# Altium project EDR_MCU_Main - Copy.PrjPcb
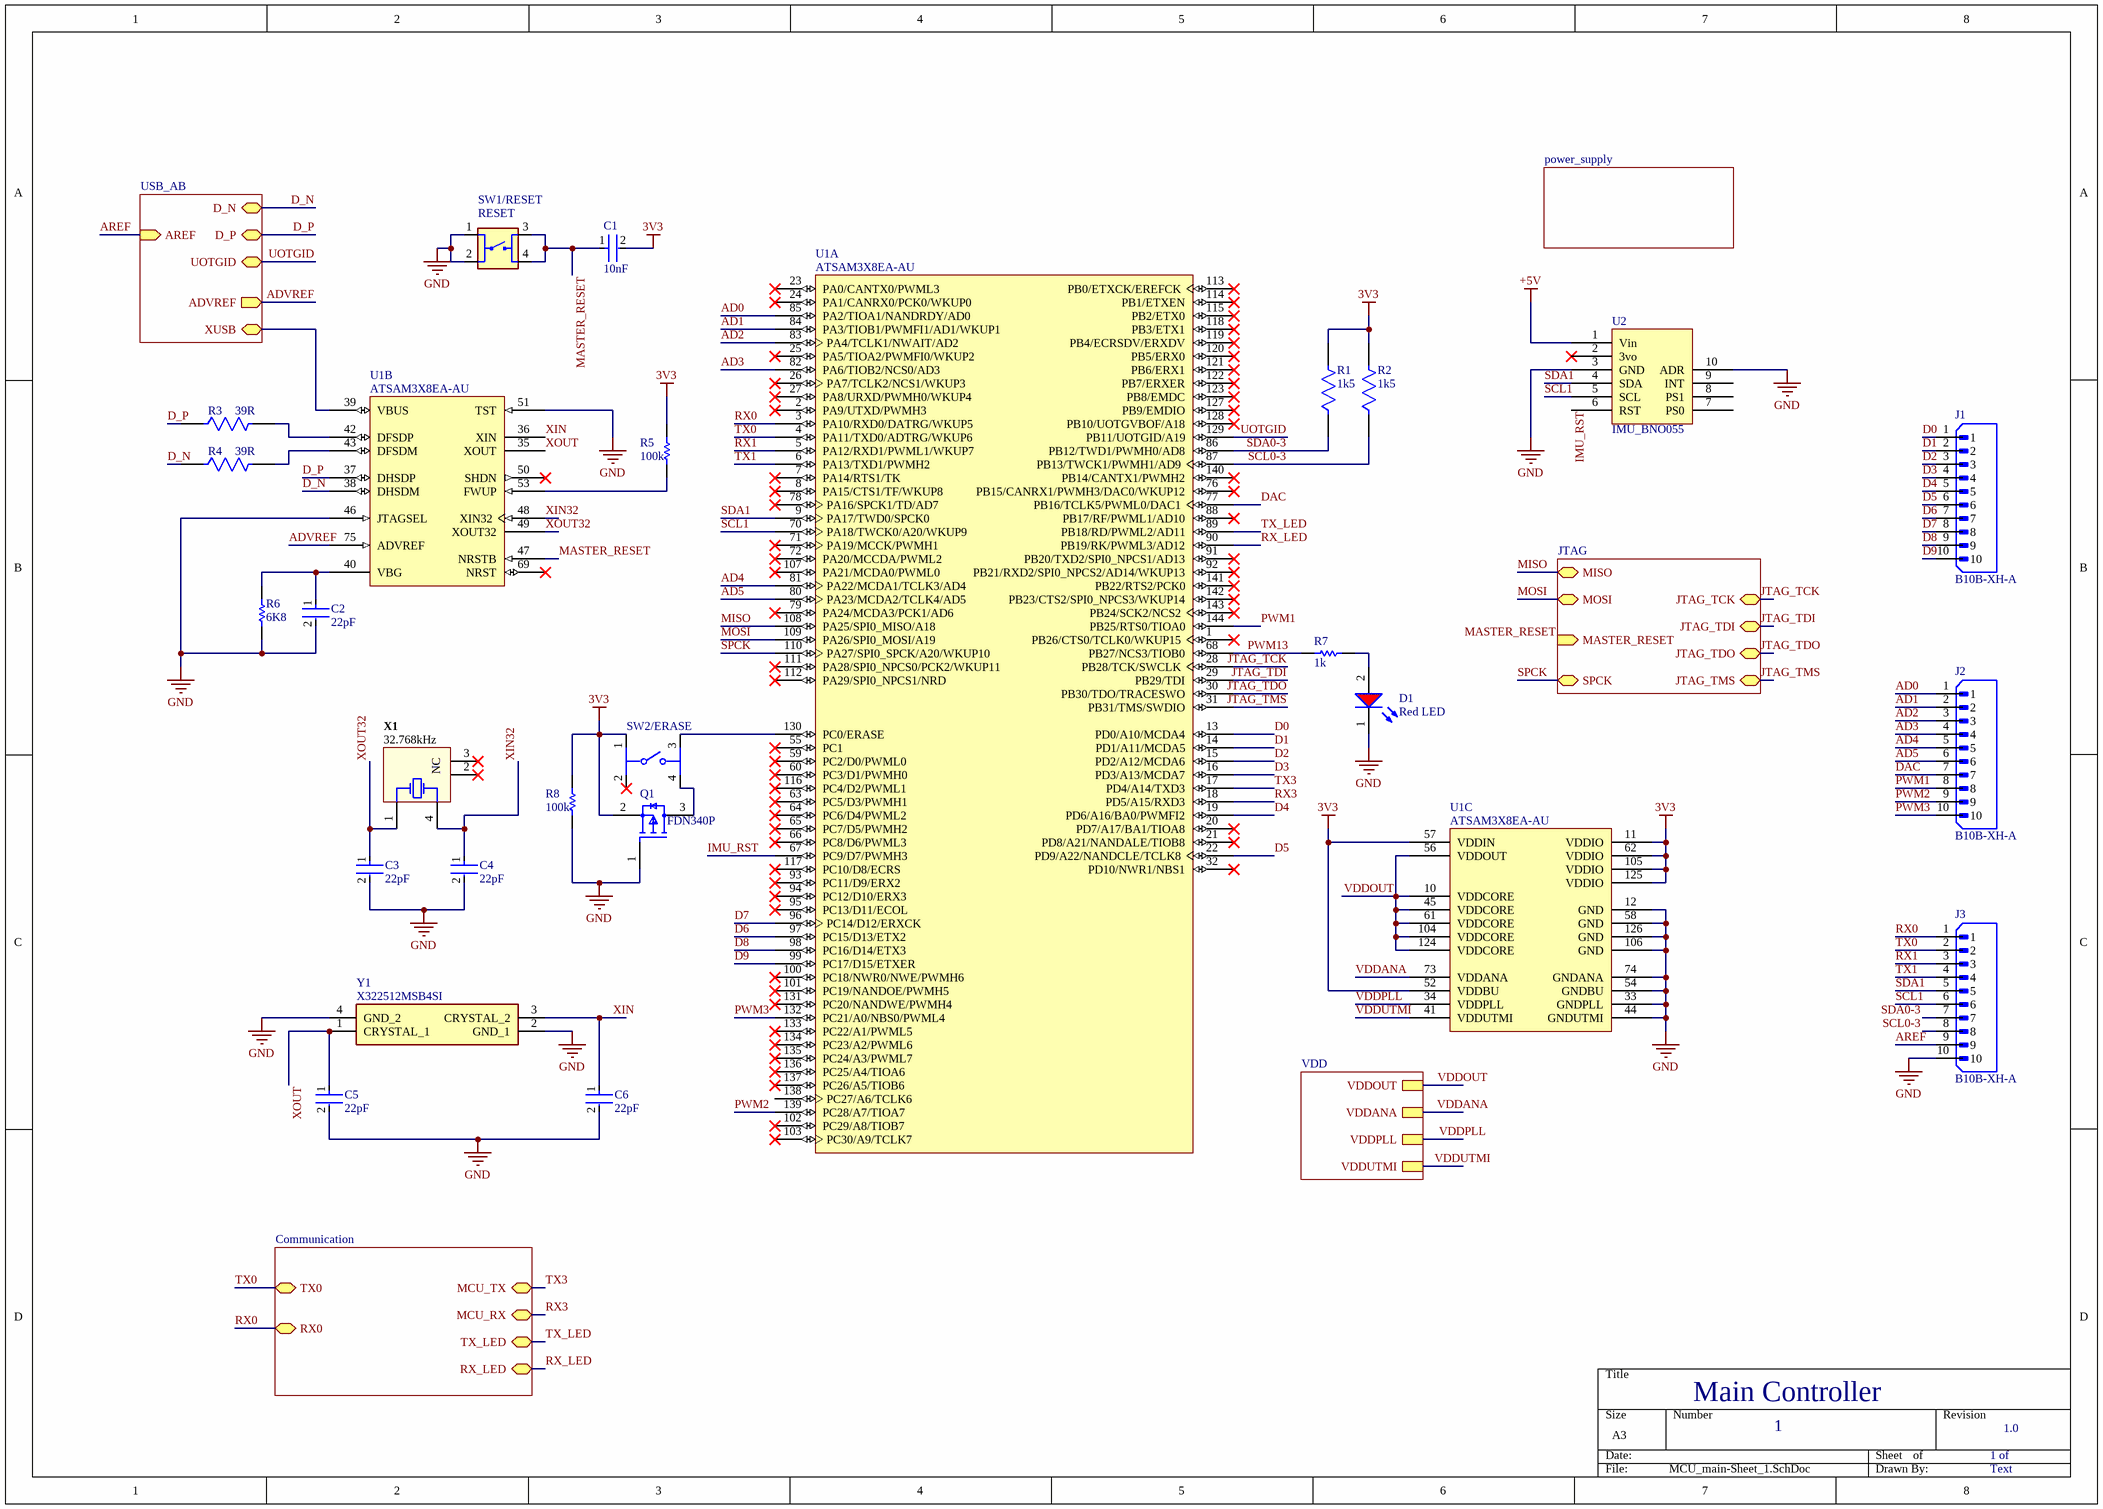
[diagram p0:  MCU_main-Sheet_1.SchDoc]
6 sheets, 98 parts. Net scope: hierarchical (ports join the sheet entries above them; power ports are global).
Board file:  PCB_1.PcbDoc
Sheets:
   MCU_main-Sheet_1.SchDoc
   USB_AB.SchDoc
   JTAG.SchDoc
   VDD.SchDoc
   power_supply.SchDoc
   Communication.SchDoc

## Sheet  MCU_main-Sheet_1.SchDoc
size A3

### Parts
C1  10nF  [FP-C0805C-DN-MFG]
C2  22pF  [FP-C0805C-DN-MFG]
C3  22pF  [FP-C0805C-DN-MFG]
C4  22pF  [FP-C0805C-DN-MFG]
C5  22pF  [FP-C0805C-DN-MFG]
C6  22pF  [FP-C0805C-DN-MFG]
D1  Red LED  [WL-SMCW_0603_150060xx75000]
J1  B10B-XH-A  [JST_B10B-XH-A]
J2  B10B-XH-A  [JST_B10B-XH-A]
J3  B10B-XH-A  [JST_B10B-XH-A]
Q1  FDN340P  [FP-527AG-MFG]
R1  1k5  [FP-RT0805-MFG]
R2  1k5  [FP-RT0805-MFG]
R3  39R  [FP-RK73H2A-MFG]
R4  39R  [FP-RK73H2A-MFG]
R5  100k  [RESC2013X50X30ML20T20]
R6  6K8  [RESC2013X50X30LL20T20]
R7  1k  [RESC2013X60X35ML10T20]
R8  100k  [RESC2013X50X30ML20T20]
SW1/RESET  RESET  [TE_4-1437565-9]
SW2/ERASE  3-1825910-1  [FP-3-1825910-1-MFG]  (value not drawn)
U1  ATSAM3X8EA-AU  [LQFP144_M]  (parts A,B,C of 3)
U2  IMU_BNO055  [IMU_BNO055-Footprint-1]
X1  32.768kHz  [ABRA-ABS25-4_V]
Y1  X322512MSB4SI  [X322512MSB4SI]

### Sub-sheets
Communication = Communication (file not in this document): MCU_TX (bidir), MCU_RX (bidir), TX_LED (bidir), RX_LED (bidir), RX0 (bidir), TX0 (bidir)
JTAG = JTAG (file not in this document): JTAG_TDI (bidir), JTAG_TCK (bidir), JTAG_TDO (bidir), JTAG_TMS (bidir), MASTER_RESET (in), MOSI (bidir), MISO (bidir), SPCK (bidir)
power_supply = power_supply (file not in this document): no entries
USB_AB = USB_AB (file not in this document): D_N (bidir), D_P (bidir), UOTGID (bidir), XUSB (bidir), ADVREF (out), AREF (in)
VDD = VDD (file not in this document): VDDOUT, VDDANA, VDDPLL, VDDUTMI

### Nets
3V3: C1.2 Q1.2(S) R1.2 R2.2 R5.2 R8.2 SW2/ERASE.1 U1.11(VDDIO) U1.52(VDDBU) U1.57(VDDIN) U1.62(VDDIO) U1.105(VDDIO) U1.125(VDDIO)
+5V: U2.1(Vin)
GND: C2.2 C3.2 C4.2 C5.2 C6.2 D1.1(K) J3.10 Q1.1(G) R6.1 R8.1 SW1/RESET.1 SW1/RESET.2 U1.12(GND) U1.33(GNDPLL) U1.44(GNDUTMI) U1.46(JTAGSEL) U1.51(TST) U1.54(GNDBU) U1.58(GND) U1.74(GNDANA) U1.106(GND) U1.126(GND) U2.3(GND) U2.10(ADR) Y1.2(GND_1) Y1.4(GND_2)
AD0: J2.1 U1.85(PA2/TIOA1/NANDRDY/AD0)
AD1: J2.2 U1.84(PA3/TIOB1/PWMFI1/AD1/WKUP1)
AD2: J2.3 U1.83(PA4/TCLK1/NWAIT/AD2)
AD3: J2.4 U1.82(PA6/TIOB2/NCS0/AD3)
AD4: J2.5 U1.81(PA22/MCDA1/TCLK3/AD4)
AD5: J2.6 U1.80(PA23/MCDA2/TCLK4/AD5)
ADVREF: U1.75(ADVREF) ; sheet USB_AB/ADVREF
AREF: J3.9 ; sheet USB_AB/AREF
D0: J1.1 U1.13(PD0/A10/MCDA4)
D1: J1.2 U1.14(PD1/A11/MCDA5)
D2: J1.3 U1.15(PD2/A12/MCDA6)
D3: J1.4 U1.16(PD3/A13/MCDA7)
D4: J1.5 U1.19(PD6/A16/BA0/PWMFI2)
D5: J1.6 U1.22(PD9/A22/NANDCLE/TCLK8)
D6: J1.7 U1.97(PC15/D13/ETX2)
D7: J1.8 U1.96(PC14/D12/ERXCK)
D8: J1.9 U1.98(PC16/D14/ETX3)
D9: J1.10 U1.99(PC17/D15/ETXER)
D_N: R4.1 U1.38(DHSDM) ; sheet USB_AB/D_N
D_P: R3.1 U1.37(DHSDP) ; sheet USB_AB/D_P
DAC: J2.7 U1.77(PB16/TCLK5/PWML0/DAC1)
IMU_RST: U1.67(PC9/D7/PWMH3) U2.6(RST)
JTAG_TCK: U1.28(PB28/TCK/SWCLK) ; sheet JTAG/JTAG_TCK
JTAG_TDI: U1.29(PB29/TDI) ; sheet JTAG/JTAG_TDI
JTAG_TDO: U1.30(PB30/TDO/TRACESWO) ; sheet JTAG/JTAG_TDO
JTAG_TMS: U1.31(PB31/TMS/SWDIO) ; sheet JTAG/JTAG_TMS
MASTER_RESET: C1.1 SW1/RESET.3 SW1/RESET.4 U1.47(NRSTB) ; sheet JTAG/MASTER_RESET
MISO: U1.108(PA25/SPI0_MISO/A18) ; sheet JTAG/MISO
MOSI: U1.109(PA26/SPI0_MOSI/A19) ; sheet JTAG/MOSI
PWM1: J2.8 U1.144(PB25/RTS0/TIOA0)
PWM2: J2.9 U1.139(PC28/A7/TIOA7)
PWM3: J2.10 U1.132(PC21/A0/NBS0/PWML4)
PWM13: R7.2 U1.68(PB27/NCS3/TIOB0)
RX0: J3.1 U1.3(PA10/RXD0/DATRG/WKUP5) ; sheet Communication/RX0
RX1: J3.3 U1.5(PA12/RXD1/PWML1/WKUP7)
RX3: U1.18(PD5/A15/RXD3) ; sheet Communication/MCU_RX
RX_LED: U1.90(PB19/RK/PWML3/AD12) ; sheet Communication/RX_LED
SCL0-3: J3.8 R2.1 U1.87(PB13/TWCK1/PWMH1/AD9)
SCL1: J3.6 U1.70(PA18/TWCK0/A20/WKUP9) U2.5(SCL)
SDA0-3: J3.7 R1.1 U1.86(PB12/TWD1/PWMH0/AD8)
SDA1: J3.5 U1.9(PA17/TWD0/SPCK0) U2.4(SDA)
SPCK: U1.110(PA27/SPI0_SPCK/A20/WKUP10) ; sheet JTAG/SPCK
TX0: J3.2 U1.4(PA11/TXD0/ADTRG/WKUP6) ; sheet Communication/TX0
TX1: J3.4 U1.6(PA13/TXD1/PWMH2)
TX3: U1.17(PD4/A14/TXD3) ; sheet Communication/MCU_TX
TX_LED: U1.89(PB18/RD/PWML2/AD11) ; sheet Communication/TX_LED
UOTGID: U1.129(PB11/UOTGID/A19) ; sheet USB_AB/UOTGID
VDDANA: U1.73(VDDANA) ; sheet VDD/VDDANA
VDDOUT: U1.10(VDDCORE) U1.45(VDDCORE) U1.56(VDDOUT) U1.61(VDDCORE) U1.104(VDDCORE) U1.124(VDDCORE) ; sheet VDD/VDDOUT
VDDPLL: U1.34(VDDPLL) ; sheet VDD/VDDPLL
VDDUTMI: U1.41(VDDUTMI) ; sheet VDD/VDDUTMI
XIN: C6.1 U1.36(XIN) Y1.3(CRYSTAL_2)
XIN32: C4.1 U1.48(XIN32) X1.4(X2)
XOUT: C5.1 U1.35(XOUT) Y1.1(CRYSTAL_1)
XOUT32: C3.1 U1.49(XOUT32) X1.1(X1)
NetC2_1: C2.1 R6.2 U1.40(VBG)
NetD1_2: D1.2(A) R7.1
NetQ1_3: Q1.3(D) SW2/ERASE.4
NetR3_2: R3.2 U1.42(DFSDP)
NetR4_2: R4.2 U1.43(DFSDM)
NetR5_1: R5.1 U1.53(FWUP)
NetSW2/ERASE_3: SW2/ERASE.3 U1.130(PC0/ERASE)
NetU1_39: U1.39(VBUS) ; sheet USB_AB/XUSB

Not connected (* = marked no-connect by the designer): SW2/ERASE 2*; U1 1(PB26/CTS0/TCLK0/WKUP15)* 2(PA9/UTXD/PWMH3)* 7(PA14/RTS1/TK)* 8(PA15/CTS1/TF/WKUP8)* 20(PD7/A17/BA1/TIOA8)* 21(PD8/A21/NANDALE/TIOB8)* 23(PA0/CANTX0/PWML3)* 24(PA1/CANRX0/PCK0/WKUP0)* 25(PA5/TIOA2/PWMFI0/WKUP2)* 26(PA7/TCLK2/NCS1/WKUP3)* 27(PA8/URXD/PWMH0/WKUP4)* 32(PD10/NWR1/NBS1)* 50(SHDN)* 55(PC1)* 59(PC2/D0/PWML0)* 60(PC3/D1/PWMH0)* 63(PC5/D3/PWMH1)* 64(PC6/D4/PWML2)* 65(PC7/D5/PWMH2)* 66(PC8/D6/PWML3)* 69(NRST)* 71(PA19/MCCK/PWMH1)* 72(PA20/MCCDA/PWML2)* 76(PB15/CANRX1/PWMH3/DAC0/WKUP12)* 78(PA16/SPCK1/TD/AD7)* 79(PA24/MCDA3/PCK1/AD6)* 88(PB17/RF/PWML1/AD10)* 91(PB20/TXD2/SPI0_NPCS1/AD13)* 92(PB21/RXD2/SPI0_NPCS2/AD14/WKUP13)* 93(PC11/D9/ERX2)* 94(PC12/D10/ERX3)* 95(PC13/D11/ECOL)* 100(PC18/NWR0/NWE/PWMH6)* 101(PC19/NANDOE/PWMH5)* 102(PC29/A8/TIOB7)* 103(PC30/A9/TCLK7)* 107(PA21/MCDA0/PWML0)* 111(PA28/SPI0_NPCS0/PCK2/WKUP11)* 112(PA29/SPI0_NPCS1/NRD)* 113(PB0/ETXCK/EREFCK)* 114(PB1/ETXEN)* 115(PB2/ETX0)* 116(PC4/D2/PWML1)* 117(PC10/D8/ECRS)* 118(PB3/ETX1)* 119(PB4/ECRSDV/ERXDV)* 120(PB5/ERX0)* 121(PB6/ERX1)* 122(PB7/ERXER)* 123(PB8/EMDC)* 127(PB9/EMDIO)* 128(PB10/UOTGVBOF/A18)* 131(PC20/NANDWE/PWMH4)* 133(PC22/A1/PWML5)* 134(PC23/A2/PWML6)* 135(PC24/A3/PWML7)* 136(PC25/A4/TIOA6)* 137(PC26/A5/TIOB6)* 138(PC27/A6/TCLK6) 140(PB14/CANTX1/PWMH2)* 141(PB22/RTS2/PCK0)* 142(PB23/CTS2/SPI0_NPCS3/WKUP14)* 143(PB24/SCK2/NCS2)*; U2 2(3vo)* 7(PS0) 8(PS1) 9(INT); X1 2(NC)* 3(NC)*

### Notes on the sheet
- Main Controller
- 1
- 1 of
- 1.0
- Text

### Library data of the parts
C1 = CMP-2007-00259-2: CAP CER 10000PF 200V X7R 0805; Manufacturer Part Number: C0805C103K2RACTU; Manufacturer: KEMET; Material: Ceramic; Temperature Coefficient: 30ppm/°C; Capacitance: 10,000 pF; Tolerance: 0.1; Value: 10,000 pF; Device Class L2: Capacitors; Voltage Rating: 200 V; Temperature Range High: +125°C; ComponentLink2Description: Datasheet; Height: 0.88mm; Octopart: https://octopart.com/c0805c103k2ractu-kemet-9138347; ComponentLink2URL: https://content.kemet.com/datasheets/KEM_C1003_C0G_SMD.pdf; Category: Cap; Temperature: -55°C to +125°C; Temperature Range Low: -55°C; Digikey Description: CAP CER 10000PF 200V X7R 0805; Temperature Characteristic: X7R; Automotive: No; Device Class L3: Ceramic Capacitors; Mouser Description: KEMET - C0805C103K2RACTU - CAP, MLCC, X7R, 10NF, 200V, 0805; RoHS: TRUE; Device Class L1: Passive Components; Lead Free: Yes; Package: C0805C-DN; Ipc Land Pattern Name: CAPC200125X78
C2-C6 = CMP-2007-00048-2: Capacitor; Ceramic; Cap; 22.0pF; Tol 5%; SMT; Vol-Rtg 50V; C0G; Tape and Reel; Manufacturer: KEMET; Manufacturer Part Number: C0805C220J5GACTU; Temperature Coefficient: 30ppm/°C; Tolerance: 0.05; Device Class L1: Passive Components; Mouser Description: Multilayer Ceramic Capacitors MLCC - SMD/SMT 50volts 22pF C0G 5%; Temperature Range Low: -55°C; Automotive: No; Voltage Rating: 50 V; Material: Ceramic; Category: Cap; Height: 0.88mm; Temperature Range High: +125°C; Capacitance: 22 pF; Digikey Description: Capacitor; Ceramic; Cap; 22.0pF; Tol 5%; SMT; Vol-Rtg 50V; C0G; Tape and Reel; Octopart: https://octopart.com/c0805c220j5gactu-kemet-145470; ComponentLink2Description: Datasheet; Device Class L2: Capacitors; Ipc Land Pattern Name: CAPC200125X78; Value: 22 pF; RoHS: TRUE; ComponentLink2URL: https://content.kemet.com/datasheets/KEM_C1003_C0G_SMD.pdf; Temperature: -55°C to +125°C; Device Class L3: Ceramic Capacitors; Lead Free: Yes; Temperature Characteristic: C0G; Package: C0805C-DN
D1 = CMP-1426-00001-4: LED Low-Power Uni-Color Red 630nm 2V 2-Pin Chip 0603(1608Metric) T/R; Max Junction Temperature (Tj): 95°C; Dominant Wavelength: 625nm; Lens Style: Clear, Rectangular; Viewing Angle: 140°; Forward Current: 100mA; Max Reverse Voltage (DC): 5V; Luminous Intensity: 250mcd; Test Current: 20mA; Power Dissipation: 72mW; Max Operating Temperature: 85°C; Mount: Surface Mount; Height: 700µm; Packaging: Tape and Reel; REACH SVHC: Unknown; Case Code (Metric): 1608; Peak Wavelength: 630nm; Forward Voltage: 2V; Case/Package: 0603; Color: Red; RoHS: Compliant; Width: 800µm; Reverse Voltage: 5V; Min Operating Temperature: -40°C; Wavelength: 625nm; Case Code (Imperial): 0603; Length: 1.6mm
J1-J3 = B10B-XH-A: MF: {'manufacturer': u'JST Sales America Inc.'}; Package: None; Price: None; Value: *; MP: B10B-XH-A; Availability: Unavailable
Q1 = CMP-2100-03638-2: MOSFET P-CH 20V 2A SSOT3; Fall Time: 11ns; Rise Time: 9ns; Voltage Rating (DC): -20V; Power Dissipation: 500mW; Nominal Vgs: -800mV; Current Rating: -2A; Gate to Source Voltage (Vgs): 8V; Rds On Max: 70mR; Turn-Off Delay Time: 27ns; Element Configuration: Single; Number of Elements: 1; Input Capacitance: 779pF; Drain to Source Resistance: 60mR; Turn-On Delay Time: 10ns; Package Quantity: 1; Mount: Surface Mount; Case/Package: SOT-23; Min Operating Temperature: -55°C; REACH SVHC: No SVHC; Weight: 0.03g; Packaging: Tape and Reel; Threshold Voltage: -800mV; Max Operating Temperature: 150°C; Dual Supply Voltage: -20V; Termination: SMD/SMT; Drain to Source Voltage (Vdss): 20V; Height: 0.94mm; Length: 2.92mm; Contact Plating: Tin; Width: 3.05mm; Drain to Source Breakdown Voltage: -20V; Max Power Dissipation: 500mW; Continuous Drain Current (ID): 2A; Number of Pins: 3; Lead Free: Lead Free; Radiation Hardening: No; On-State Resistance: 70MR
R1 R2 = CMP-03412-013884-1: RES SMD 1.5K OHM 0.25% 1/8W 0805; Manufacturer Part Number: RT0805CRE071K5L; Manufacturer: Yageo; Resistance: 1.5KΩ; Power Rating: 0.125W; Temperature Coefficient: 50 ppm/°C; Tolerance: 0.005; Voltage Rating: 150V; Value: 1.5KΩ; Temperature Range Low: -55°C; Height: 0.6mm; Octopart: https://octopart.com/rt0805cre071k5l-yageo-1182744; Lead Free: Yes; Device Class L2: Resistors; Package: RT0805; Device Class L1: Passive Components; Composition: Thin Film; Automotive: No; Temperature Range High: +155°C; Category: Res; Temperature: -55°C to +155°C; Device Class L3: Chip SMD Resistors; RoHS: TRUE; Digikey Description: RES SMD 1.5K OHM 0.25% 1/8W 0805; Footprint Url: http://www.yageo.com/exep/pages/download/literatures/PYu-R_Mount_10.pdf; ComponentLink2Description: Datasheet; ComponentLink2URL: http://www.yageo.com/documents/recent/PYu-RT_1-to-0.01_RoHS_L_9.pdf; Ipc Land Pattern Name: RESC200125X50; Series: RT
R3 R4 = CMP-04015-075652-1: 39Ω ±1% 0.25W Chip Resistor 0805 Flat Chip (Anti-Sulfuration) AEC-Q200 Qualified; Power Rating: 125mW; Temperature Coefficient: 100ppm/°C; Voltage Rating: 150V; Case Code (Imperial): 0805; Case/Package: 0805; Weight: 0.000194oz; Package Quantity: 5000; Resistance: 39R; Height: 0.5mm; Max Operating Temperature: 155°C; RoHS Compliant: Yes; Termination: SMD/SMT; Min Operating Temperature: -55°C; Tolerance: 1%; Packaging: Tape and Reel; Length: 2mm; Case Code (Metric): 2012; Width: 1.2mm
R5 R8 = CMP-2001-04900-1: Fixed Resistor, Metal Glaze/thick Film, 0.125W, 100000ohm, 150V, 5% +/-Tol, 200ppm/Cel, Surface Mount, 0805; Manufacturer: Vishay Dale; Part Number: CRCW0805100KJNEA
R6 = CMP-2001-04089-1: Manufacturer: Vishay Dale; Part Number: CRCW08056K80JNEA
R7 = CMP-2100-03671-1: Chip Resistor, 1 KOhm, +/- 1%, 125 mW, -55 to 155 degC, 0805 (2012 Metric), RoHS, Tape and Reel; Manufacturer: Yageo; Temperature Coefficient: 100ppm/degreesC; Voltage Rating (DC): 150V; Max Power Dissipation: 125mW; Resistance: 1KOhm; Number of Pins: 2; Number of Terminations: 2; Datasheet URL: http://www.yageo.com/NewPortal/yageodocoutput?fileName=/pdf/R-Chip/PYu-RC_Group_51_RoHS_L_5.pdf; Length: 0.079inch; Package Description: 2-Pin Surface Mounted Device, Body 2 x 1.25 mm; Depth: 1.25mm; Height: 0.024inch; Military Standard: Not; Case/Package: 0805; Package Reference: 0805; RoHSCompliant: true; Lead Free: LeadFree; Packaging: TapeandReel; Package Quantity: 1; Datasheet Version: Rev. 5, 10/2016; Tolerance: 1%; Min Operating Temperature: -55degC; Voltage Rating: 150V; Composition: ThickFilm; Case Code (Imperial): 0805; Power Rating: 125mW; Width: 0.049inch; Case Code (Metric): 2012; Manufacturer URL: http://www.yageo.com/; Max Operating Temperature: 155degC; REACH SVHC: Unknown; Termination: SMD/SMT
SW1/RESET = 4-1437565-9: Alcoswitch, Switch, Tactile, 50 mA, SPST, Pushbutton, Off[On], FSM6JSMA | TE Connectivity FSM6JSMA; Contact_Current_Rating: 50 mA; Configuration_Pole-Throw: Single Pole - Single Throw; SnapEDA_Link: https://www.snapeda.com/parts/FSM6JSMA/TE+Connectivity+ALCOSWITCH+Switches/view-part/?ref=snap; Package: None; Value: *; MF: TE Connectivity; MP: FSM6JSMA; EU_RoHS_Compliance: Compliant; Check_prices: https://www.snapeda.com/parts/FSM6JSMA/TE+Connectivity+ALCOSWITCH+Switches/view-part/?ref=eda
SW2/ERASE = CMP-03407-000001-1: SWITCH TACTILE SPST-NO 0.05A 24V; Manufacturer: TE Connectivity; Operating Force: 160gf; Contact Current Rating: 50mA; Contact Resistance: 100mΩ; Electromechanical Life: 100000Cycles; Device Class L1: Electromechanical; ComponentLink2URL: https://www.te.com/commerce/DocumentDelivery/DDEController?Action=srchrtrv&DocNm=1825910&DocType=Customer+Drawing&DocLang=English; Category: Switch; Device Class L2: Switches; Temperature: -35°C to +85°C; RoHS: TRUE; Mount: Through Hole; Manufacturer Part Number: 3-1825910-1; Automotive: No; Lead Free: Yes; Device Class L3: Tactile Switches; ComponentLink2Description: Datasheet; Temperature Range High: +85°C; Height: 17.3mm; Package: 0; Temperature Range Low: -35°C; Throw Configuration: SPST-NO; Digikey Description: SWITCH TACTILE SPST-NO 0.05A 24V; Octopart: https://octopart.com/3-1825910-1-te+connectivity-46506874
U1 = CMP-0076-00188-1: SAM3X ARM Cortex-M3 Flash-based Microcontroller, 512 KB Flash, 96 KB SRAM, 103 User I/Os, 1.62 to 3.6 V, -40 to 85 degC, 144-Pin LQFP, RoHS; Manufacturer: Atmel; UART: 5; Max. Operating Freq.: 84 MHz; ADC Resolution: 12 bits; Flash: 512 Kbytes; ADC Channels: 16; SRAM: 96 Kbytes; Max I/O Pins: 103; DAC Channels: 2; SPI: 4; # of Touch Channels: 32; Mounting Technology: Surface Mount; Operating Voltage: 1.62 to 3.6 V; ComponentLink2URL: http://www.atmel.com/Images/doc11057.pdf; CAN: 2; ComponentLink1Description: Manufacturer URL; RoHS: TRUE; PartNumber: ATSAM3X8EA-AU; Temp. Range: -40 to 85 degC; PackageVersion: 11057B; PackageDescription: 100-Pin Quad Flat Package, Body 20 x 20 mm, Pitch 0.5 mm; ComponentLink2Description: Datasheet; DatasheetVersion: 11057B; ComponentLink1URL: http://www.atmel.com/; ComponentLink3Description: Package Specification; ComponentLink3URL: http://www.atmel.com/Images/doc11057.pdf; PackageReference: LQFP-144
U2 = CMP-010-00026-2: IMU Sensor; Min Supply Voltage: 3.3V; Max Supply Voltage: 5V; ComponentLink1Description: Datasheet; Sensor Type: IMU; Mounting Technology: Through Hole; Case/Package: Module; Pins: 10; ComponentLink1URL: https://cdn-learn.adafruit.com/downloads/pdf/adafruit-bno055-absolute-orientation-sensor.pdf
X1 = CMP-2000-05036-1: Low Frequency Crystal, 32.768 KHz, 6 pF, +/- 20 ppm, -40 to 85 degC, 4-Pin SMD, RoHS, Tape and Reel; Manufacturer: Abracon; Tolerance: 20PPM; ESR: 50kOhms; Case Width: 3.8mm; Case Height: 2.5mm; Case Length: 8mm; Load Capacitance: 6pF; Operating Temperature Range: -40Cto+85C; Package Reference: ABS25; Factory Pack Quantity: 3000; Package Description: 4-Pin Surface Mount Device, Body 8 x 3.8 mm, Pitch 5.5 mm; Frequency: 32.768kHz; Termination Style: SMD/SMT; Manufacturer URL: http://www.abracon.com/; Type: LowFrequencyCrystal; Dimensions: 3.8mmWx8mmLx2.5mmH; Product Category: Crystals; Series: ABS25; RoHS: Details; Package / Case: 8mmx3.8mm; Datasheet Version: Jun-17; Brand: ABRACON; Datasheet URL: https://datasheet.ciiva.com/854/abs25-854528.pdf; Packaging: Reel; Mounting Style: SMD/SMT
Y1 = X322512MSB4SI: Crystal or Oscillator; Manufacturer_Name: Yangxing Tech; Datasheet Link: https://datasheet.lcsc.com/szlcsc/Yangxing-Tech-X322512MSB4SI_C9002.pdf; Height: 0.8mm; Manufacturer_Part_Number: X322512MSB4SI

## Sheet  USB_AB.SchDoc
size A4
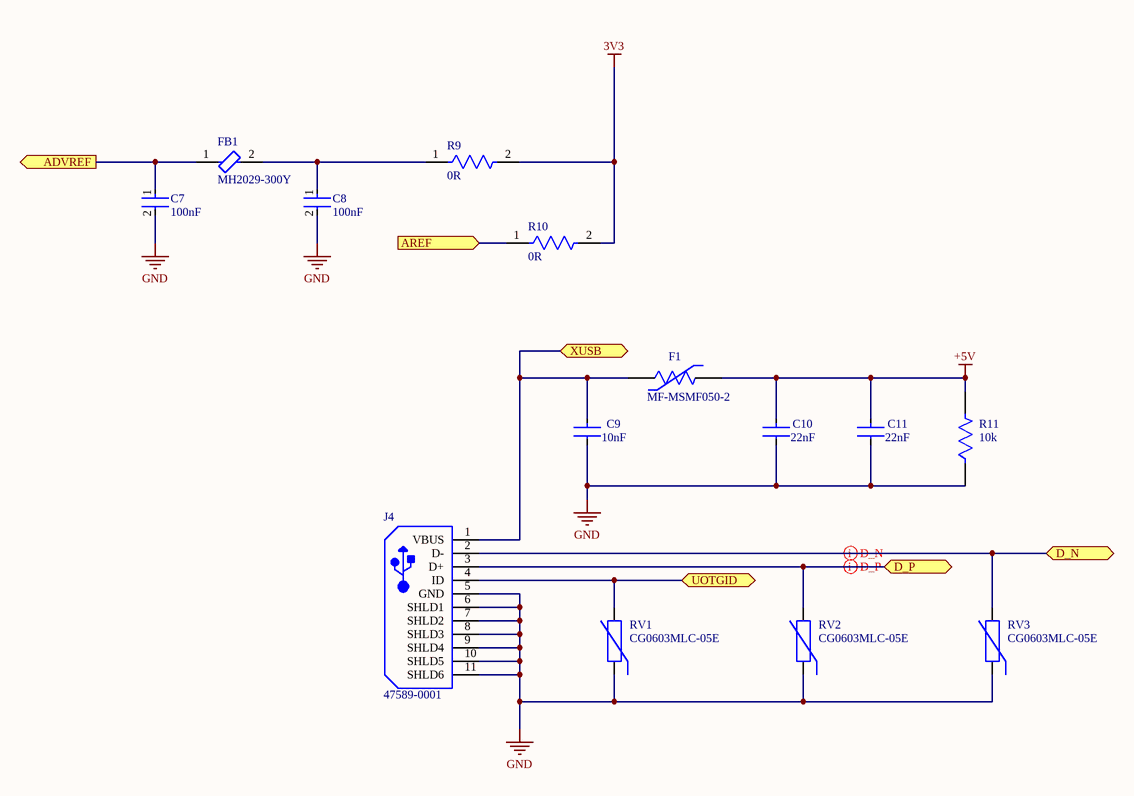
[diagram p1:  USB_AB.SchDoc]

### Parts
C7  100nF  [FP-0805-L_2_01_0_2-W_1_25-IPC_B]
C8  100nF  [FP-0805-L_2_01_0_2-W_1_25-IPC_B]
C9  10nF  [FP-GRM219-0_1-IPC_B]
C10  22nF  [FP-GRM21B-0_1-IPC_A]
C11  22nF  [FP-GRM21B-0_1-IPC_A]
F1  MF-MSMF050-2  [FP-MF-MSMF050-2-MFG]
FB1  MH2029-300Y  [FP-MH2029-MFG]
J4  47589-0001  [MOLX-47589-0001_V]
R9  0R  [FP-CRCW0805-e3-IPC_B]
R10  0R  [FP-CRCW0805-e3-IPC_B]
R11  10k  [FP-CRCW0805-e3-IPC_A]
RV1  CG0603MLC-05E  [BOUR-CG0603-2_V]
RV2  CG0603MLC-05E  [BOUR-CG0603-2_V]
RV3  CG0603MLC-05E  [BOUR-CG0603-2_V]

### Ports
ADVREF (out), AREF (in), D_N (bidir), D_P (bidir), UOTGID (bidir), XUSB (bidir)

### Nets
3V3: R9.2 R10.2
+5V: C10.1 C11.1 F1.2 R11.2
GND: C7.2 C8.2 C9.2 C10.2 C11.2 J4.5(GND) J4.6(SHLD1) J4.7(SHLD2) J4.8(SHLD3) J4.9(SHLD4) J4.10(SHLD5) J4.11(SHLD6) R11.1 RV1.1 RV2.1 RV3.1
NetC7_1: C7.1 FB1.1 ; port ADVREF
NetC8_1: C8.1 FB1.2 R9.1
NetC9_1: C9.1 F1.1 J4.1(VBUS) ; port XUSB
NetJ4_2: J4.2(D-) RV3.2 ; port D_N
NetJ4_3: J4.3(D+) RV2.2 ; port D_P
NetJ4_4: J4.4(ID) RV1.2 ; port UOTGID
NetR10_1: R10.1 ; port AREF

### Layout directives
differential pair: NetJ4_2, NetJ4_3

### Library data of the parts
C7 C8 = CMP-2007-04174-2: General Purpose Ceramic Capacitor, 0805, 100nF, 10%, X7R, 15%, 100V; Packaging: Tape and Reel; Min Operating Temperature: -55°C; Dielectric Material: Ceramic; Height: 1.4mm; Voltage Rating: 100V; Termination: SMD/SMT; Case Code (Imperial): 0805; Case Code (Metric): 2012; Case/Package: 0805; Construction: Flat; Radiation Hardening: No; Series: -; Dielectric: X7R; Package Quantity: 2000; Mount: Surface Mount; Capacitance: 100nF; Contact Plating: Tin; Voltage: 100V; Lead Free: Lead Free; Depth: 1.25mm; RoHS Compliant: Yes; Number of Pins: 2; Max Operating Temperature: 125°C; Length: 2.01mm; Voltage Rating (DC): 100V; Thickness: 0.055inch; REACH SVHC: No SVHC; Width: 0.049inch; Tolerance: 10%
C9 = CMP-2007-00135-2: Chip Multilayer Ceramic Capacitors for General Purpose, 0805, 10000pF, C0G, 30ppm/°C, 5%, 50V; Insulation Resistance: 10GR; Max Operating Temperature: 125°C; Height: 0.85mm; Voltage: 50V; Dielectric Material: Ceramic; Voltage Rating: 50V; Dielectric: C0G; Thickness: 0.037inch; REACH SVHC: No SVHC; Lead Free: Lead Free; Depth: 1.25mm; Min Operating Temperature: -55°C; Package Quantity: 1; Packaging: Tape and Reel; Case Code (Imperial): 0805; Case/Package: 0805; Mount: Surface Mount; Width: 0.049inch; Case Code (Metric): 2012; Length: 2mm; Termination: SMD/SMT; Material: Ceramic; Tolerance: 5%; Temperature Coefficient: 30ppm/°C; Capacitance: 10nF; Number of Pins: 2; Voltage Rating (DC): 50V; Radiation Hardening: No
C10 C11 = CMP-2007-03457-2: Chip Multilayer Ceramic Capacitors for General Purpose, 0805, 22000pF, C0G, 30ppm/°C, 5%, 50V; Voltage: 25V; Tolerance: 5%; Dielectric: C0G; Material: Ceramic; Case Code (Metric): 2012; Thickness: 0.053inch; Temperature Coefficient: 30ppm/°C; Lead Free: Lead Free; Height: 1.25mm; Radiation Hardening: No; Max Operating Temperature: 125°C; Termination: SMD/SMT; Mount: Surface Mount; Case Code (Imperial): 0805; Capacitance: 22nF; Packaging: Tape and Reel; Min Operating Temperature: -55°C; Number of Pins: 2; Voltage Rating (DC): 50V; Voltage Rating: 50V; Package Quantity: 1; REACH SVHC: No SVHC; Length: 2mm; Case/Package: 0805; Width: 0.049inch; Depth: 1.25mm
F1 = CMP-2100-03653-2: PTC RESET FUSE 15V 500MA 1812; Manufacturer: Bourns; Value: 0.15-1Ω; Trip Current: 1A; Automotive Grade: Grade 3; Trip Time: 0.15s; Current Rating: 100A; Hold Current: 0.5A; Height: 0.85mm; Package: 1812; Voltage Rating: 15V; Temperature Range High: +85°C; Device Class L2: PTC Resettable Fuses; Lead Free: Yes; ComponentLink2URL: http://www.bourns.com/docs/Product-Datasheets/mfmsmf.pdf; Ambient Temperature Range High: +85°C; Mouser Description: PTC Resettable Fuse 0.5A(hold) 1A(trip) 15V 100A 0.8W 0.15s 0.15Ohm SMD Solder Pad 1812 T/R; Digikey Description: PTC RESET FUSE 15V 500MA 1812; Manufacturer Part Number: MF-MSMF050-2; Resistance: 0.15-1Ω; Category: Fuse; ComponentLink2Description: Datasheet; Automotive: Yes; Temperature Range Low: -40°C; RoHS: TRUE; Device Class L1: Circuit Protection; Temperature: -40°C to +85°C; Octopart: https://octopart.com/mf-msmf050-2-bourns-28047; Ambient Temperature Range Low: -40°C; Device Class L3: unset
FB1 = CMP-07252-000001-1: FERRITE BEAD 30 OHM 0805 1LN; Manufacturer: Bourns; Series Resistance: 25mΩ; Resistance: 30Ω; Value: 30Ω; Impedance At Frequency: 30Ω @ 100MHz; Rms Current: 3A; Tolerance: 25%; RoHS: TRUE; Manufacturer Part Number: MH2029-300Y; Temperature Range High: +125°C; Device Class L3: Ferrite Beads and Chips; Core Material: Ferrite; ComponentLink2Description: Datasheet; Category: FBead; Octopart: https://octopart.com/mh2029-300y-bourns-756929; Digikey Description: FERRITE BEAD 30 OHM 0805 1LN; Device Class L2: EMI / RFI Components; Lead Free: Yes; Mouser Description: Ferrite Beads 30 ohms 25% HIGH CURRENT; Automotive: No; Ipc Land Pattern Name: CAPC200120X90; Temperature: -55°C to +125°C; Device Class L1: Passive Components; Height: 1.1mm; ComponentLink2URL: https://www.bourns.com/docs/Product-Datasheets/mh.pdf; Package: MH2029; Temperature Range Low: -55°C
J4 = CMP-2000-05610-1: Right Angle Female Type AB Micro USB Connector, 30 V, 1.8 A, -30 to 85 degC, RoHS, Tape and Reel; Number of Ports: 1Port; Current Rating: 1.8A; Brand: Molex; Connector Type: MicroUSBTypeABreceptacle; Number of Contacts: 5Contact; Voltage Rating: 30VAC; Color: Black; Product: MicroUSBTypeABConnectors; Package URL: http://www.molex.com/pdm_docs/sd/475890001_sd.pdf; Contact Plating: Gold; Datasheet URL: http://www.molex.com/webdocs/datasheets/pdf/en-us/0475890001_IO_CONNECTORS.pdf; Operating Temperature Range: -20Cto+85C; Termination Style: SMD/SMT; Mounting Angle: Right; Package Reference: 47589-0001; Gender: Female; Package Description: Micro USB Connector, Pitch 0.65 mm, 5 Positions, Body 7.5 x 5.6 mm; Mounting Technology: SurfaceMount; Contact Material: CopperAlloy; Packaging: Reel; RoHS: True; Standard: USB; Manufacturer URL: http://www.molex.com/; Manufacturer: Molex; Datasheet Version: 12/2016; Product Category: USBConnectors; Series: 47589
R9 R10 = CMP-2001-04897-2: RES Thick Film, 0Ω, 0.125W, 0805; Power Rating: 125mW; Resistance: 0mR; Voltage Rating: 150V; Length: 2mm; Width: 0.049inch; Weight: 0.000194oz; Composition: Thick Film; Contact Plating: Tin; Max Power Dissipation: 125mW; Min Operating Temperature: -55°C; Packaging: Tape and Reel; Number of Terminations: 2; Package Quantity: 10000; Case Code (Imperial): 0805; Military Standard: Not; Height: 0.02inch; Features: Automotive AEC-Q200; Depth: 1.25mm; Radiation Hardening: No; Lead Free: Lead Free; Case Code (Metric): 2012; Case/Package: 0805; Voltage Rating (DC): 150V; Termination: SMD/SMT; Max Operating Temperature: 155°C
R11 = CMP-2001-04908-2: RES Thick Film, 10kΩ, 1%, 0.125W, 100ppm/°C, 0805; Resistance: 10kR; Voltage Rating (DC): 150V; Power Rating: 125mW; Weight: 0.000194oz; Package Quantity: 5000; Military Standard: Not; Max Operating Temperature: 155°C; Temperature Coefficient: 100ppm/°C; Contact Plating: Tin; Width: 1.25mm; Height: 0.45mm; Radiation Hardening: No; Tolerance: 1%; Min Operating Temperature: -55°C; Voltage Rating: 150V; Length: 2mm; Depth: 1.25mm; Termination: SMD/SMT; Packaging: Tape and Reel; Case/Package: 0805; Case Code (Metric): 2012; Lead Free: Lead Free; Case Code (Imperial): 0805; Composition: Thick Film
RV1-RV3 = CMP-0584-00001-2: ESD Protector, 5 V Supply, -40 to 85 degC, 1.6 x 0.8 x 0.55 mm SMD, RoHS, Tape and Reel; Manufacturer: Bourns; VC: 20 V; VT: 150 V; RT: 1 ns; VDC: 5 V; CO: 0.5 pF; PartNumber: CG0603MLC-05E; ComponentLink1Description: Manufacturer URL; ComponentLink1URL: http://www.bourns.com/; Packing: Tape and Reel; Mounting Technology: Surface Mount; ComponentLink2Description: Datasheet; RoHS: TRUE; Operating Temperature: -40 to 85 degC; DatasheetVersion: Rev. S; PackageDescription: 2-Pin SMD, Body 1.6 x 0.8 mm, Pitch 1.52 mm; PackageReference: CG0603-2; ComponentLink2URL: http://www.bourns.com/data/global/pdfs/MLC.pdf

## Sheet  JTAG.SchDoc
size A4
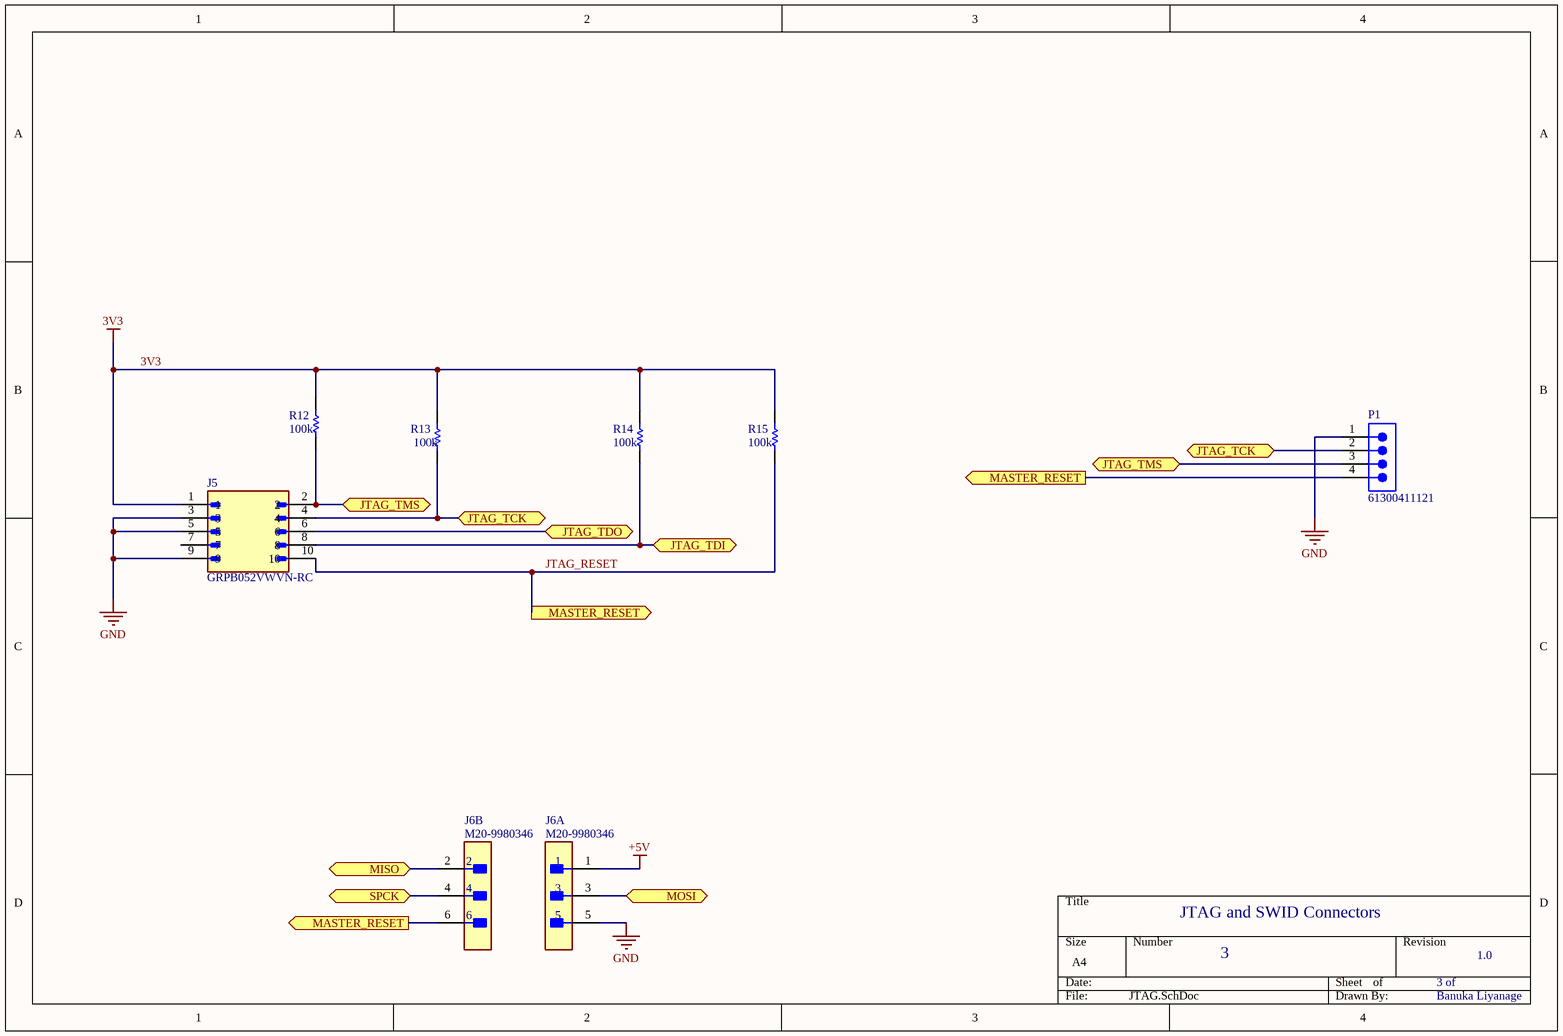
[diagram p2:  JTAG.SchDoc]

### Parts
J5  GRPB052VWVN-RC  [SULLINS_GRPB052VWVN-RC]
J6  M20-9980346  [FP-M20-9980346-MFG]  (parts A,B of 2)
P1  61300411121  [61300411121]
R12  100k  [RESC2013X50X30ML20T20]
R13  100k  [RESC2013X50X30ML20T20]
R14  100k  [RESC2013X50X30ML20T20]
R15  100k  [RESC2013X50X30ML20T20]

### Ports
JTAG_TCK (bidir), JTAG_TDI (bidir), JTAG_TDO (bidir), JTAG_TMS (bidir), MASTER_RESET (out), MISO (bidir), MOSI (bidir), SPCK (bidir)

### Nets
3V3: J5.1 R12.2 R13.2 R14.2 R15.2
+5V: J6.1
GND: J5.3 J5.5 J5.9 J6.5 P1.1
JTAG_RESET: J5.10 J6.6 P1.4 R15.1 ; port MASTER_RESET
NetJ5_2: J5.2 P1.3 R12.1 ; port JTAG_TMS
NetJ5_4: J5.4 P1.2 R13.1 ; port JTAG_TCK
NetJ5_6: J5.6 ; port JTAG_TDO
NetJ5_8: J5.8 R14.1 ; port JTAG_TDI
NetJ6_2: J6.2 ; port MISO
NetJ6_3: J6.3 ; port MOSI
NetJ6_4: J6.4 ; port SPCK

Not connected (* = marked no-connect by the designer): J5 7

### Notes on the sheet
- JTAG and SWID Connectors
- 3
- 3 of
- 1.0
- Banuka Liyanage

### Library data of the parts
J5 = GRPB052VWVN-RC: Connector Header Through Hole 10 position 0.050 (1.27mm); MF: Sullins; Package: None; Price: None; Check_prices: https://www.snapeda.com/parts/GRPB052VWVN-RC/Sullins+Connector+Solutions/view-part/?ref=eda; Value: *; SnapEDA_Link: https://www.snapeda.com/parts/GRPB052VWVN-RC/Sullins+Connector+Solutions/view-part/?ref=snap; MP: GRPB052VWVN-RC; Availability: In Stock; Purchase-URL: https://pricing.snapeda.com/search/part/GRPB052VWVN-RC/?ref=eda
J6 = CMP-2000-06636-2: CONN HEADER VERT 6POS 2.54MM; Manufacturer: Harwin; Current Rating: 3A; Number Of Contacts: 6; Conn Gender: Male; Conn Orientation: Vertical; Device Class L1: Connectors; ComponentLink2Description: Datasheet; Height: 8.99mm; Temperature Range High: +105°C; Contact Material: Tin,Nickel; RoHS: TRUE; Temperature Range Low: -40°C; ComponentLink2URL: https://cdn.harwin.com/pdfs/M20-998.pdf; Digikey Description: CONN HEADER VERT 6POS 2.54MM; Pitch: 2.54mm; Package: M20-9980346; Device Class L2: Headers and Wire Housings; Manufacturer Part Number: M20-9980346; Number Of Rows: 2; Category: Conn; Lead Free: Yes; Mouser Description: 2.54mm (0.1") Pitch DIL Vertical PC Tail Pin Header, 6.1mm mating pin height, tin, 3+3 contacts; Temperature: -40°C to +105°C; Device Class L3: unset; Octopart: https://octopart.com/m20-9980346-harwin-5436545; Automotive: No
P1 = CMP-1502-01064-3: NexarPartId: 32855522; Operating Supply Voltage: 250V; Pitch: 2.54mm; Contact Resistance: 20mΩ; Number of Positions: 4; Current Rating: 3A; Connector Type: Male Pin; Gender: Male; Contact Plating: Gold; Height: 8.89mm; Lead Pitch: 2.54mm; Lead Free: Lead Free; Contact Mating Length: 5.9944mm; Number of Rows: 1; Termination: Solder; Packaging: Bulk; REACH SVHC: Unknown; Min Operating Temperature: -40°C; RoHS: Compliant; Number of Contacts: 4; Voltage Rating: 250V; Color: Black; Max Operating Temperature: 105°C; Contact Material: Copper; Mount: Through Hole; Orientation: Vertical; Number of Pins: 4
R12-R15 = CMP-2001-04900-1: as R5 on sheet  MCU_main-Sheet_1

## Sheet  VDD.SchDoc
size A4
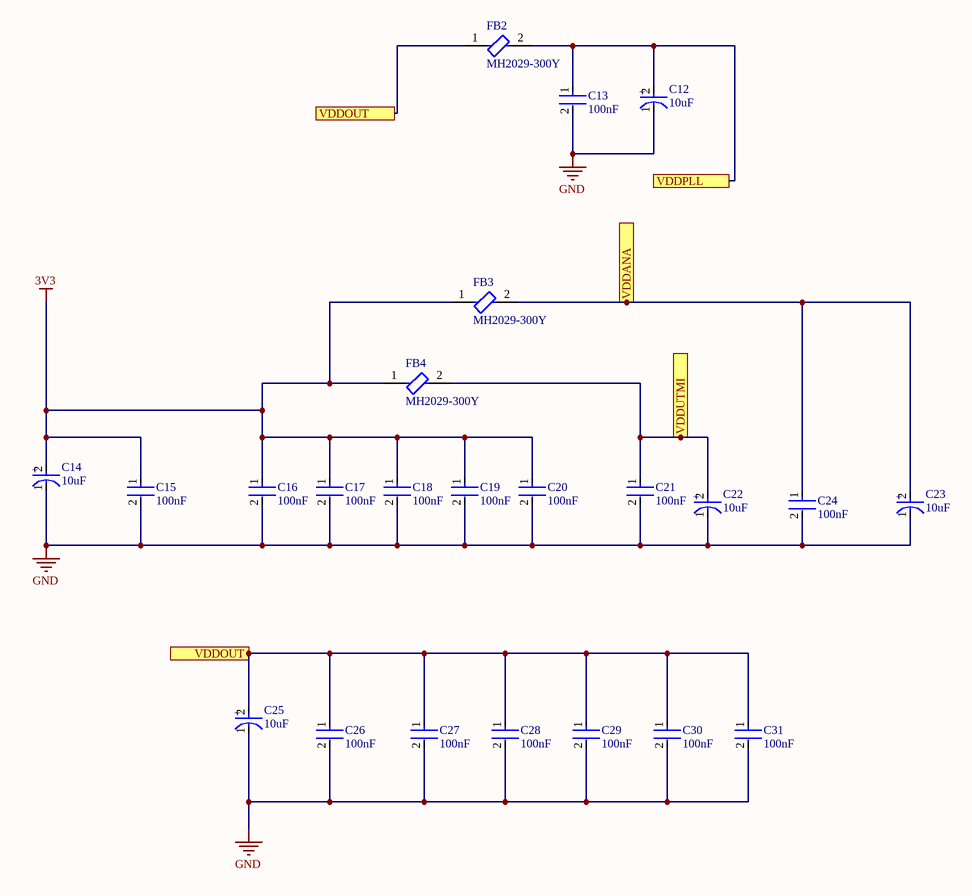
[diagram p3:  VDD.SchDoc]

### Parts
C12  10uF  [FP-TAJP-MFG]
C13  100nF  [FP-0805-L_2_01_0_2-W_1_25-IPC_B]
C14  10uF  [FP-TAJP-MFG]
C15  100nF  [FP-0805-L_2_01_0_2-W_1_25-IPC_B]
C16  100nF  [FP-0805-L_2_01_0_2-W_1_25-IPC_B]
C17  100nF  [FP-0805-L_2_01_0_2-W_1_25-IPC_B]
C18  100nF  [FP-0805-L_2_01_0_2-W_1_25-IPC_B]
C19  100nF  [FP-0805-L_2_01_0_2-W_1_25-IPC_B]
C20  100nF  [FP-0805-L_2_01_0_2-W_1_25-IPC_B]
C21  100nF  [FP-0805-L_2_01_0_2-W_1_25-IPC_B]
C22  10uF  [FP-TAJP-MFG]
C23  10uF  [FP-TAJP-MFG]
C24  100nF  [FP-0805-L_2_01_0_2-W_1_25-IPC_B]
C25  10uF  [FP-TAJP-MFG]
C26  100nF  [FP-0805-L_2_01_0_2-W_1_25-IPC_B]
C27  100nF  [FP-0805-L_2_01_0_2-W_1_25-IPC_B]
C28  100nF  [FP-0805-L_2_01_0_2-W_1_25-IPC_B]
C29  100nF  [FP-0805-L_2_01_0_2-W_1_25-IPC_B]
C30  100nF  [FP-0805-L_2_01_0_2-W_1_25-IPC_B]
C31  100nF  [FP-0805-L_2_01_0_2-W_1_25-IPC_B]
FB2  MH2029-300Y  [FP-MH2029-MFG]
FB3  MH2029-300Y  [FP-MH2029-MFG]
FB4  MH2029-300Y  [FP-MH2029-MFG]

### Ports
VDDANA, VDDOUT, VDDPLL, VDDUTMI

### Nets
3V3: C14.2(A) C15.1 C16.1 C17.1 C18.1 C19.1 C20.1 FB3.1 FB4.1
GND: C12.1(C) C13.2 C14.1(C) C15.2 C16.2 C17.2 C18.2 C19.2 C20.2 C21.2 C22.1(C) C23.1(C) C24.2 C25.1(C) C26.2 C27.2 C28.2 C29.2 C30.2 C31.2
NetC12_2: C12.2(A) C13.1 FB2.2 ; port VDDPLL
NetC21_1: C21.1 C22.2(A) FB4.2 ; port VDDUTMI
NetC23_2: C23.2(A) C24.1 FB3.2 ; port VDDANA
NetC25_2: C25.2(A) C26.1 C27.1 C28.1 C29.1 C30.1 C31.1 FB2.1 ; port VDDOUT

### Library data of the parts
C12 C14 C22 C23 C25 = CMP-2007-04028-2: 10uF 10V  ±20% 6Ω 0805  SMD Tantalum Capacitor; Dissipation Factor: 8%; ESR (Equivalent Series Resistance): 6R; Polarity: Polar; Leakage Current: 1uA; Height: 1.5mm; Packaging: Tape and Reel; Max Operating Temperature: 125°C; Lead Free: Lead Free; Length: 2.05mm; RoHS Compliant: Yes; Number of Pins: 2; Case Code (Metric): 2012; Series: TAJ; Height - Seated (Max): 0.059inch; Mount: Surface Mount; REACH SVHC: No SVHC; Depth: 1.35mm; Tolerance: 20%; Case Code (Imperial): 0805; Dielectric Material: Tantalum; Features: General Purpose; Voltage: 10V; Capacitance: 10uF; Package Quantity: 1; Case/Package: 0805; Voltage Rating (DC): 10V; Termination: SMD/SMT; Width: 0.053inch; Min Operating Temperature: -55°C; Voltage Rating: 10V
C13 C15-C21 C24 C26-C31 = CMP-2007-04174-2: as C7 on sheet  USB_AB; Packaging: Tape and Reel; Min Operating Temperature: -55°C; Dielectric Material: Ceramic; Height: 1.4mm; Voltage Rating: 100V; Termination: SMD/SMT; Case Code (Imperial): 0805; Case Code (Metric): 2012; Case/Package: 0805; Construction: Flat; Radiation Hardening: No; Series: -; Dielectric: X7R; Package Quantity: 2000; Mount: Surface Mount; Capacitance: 100nF; Contact Plating: Tin; Voltage: 100V; Lead Free: Lead Free; Depth: 1.25mm; RoHS Compliant: Yes; Number of Pins: 2; Max Operating Temperature: 125°C; Length: 2.01mm; Voltage Rating (DC): 100V; Thickness: 0.055inch; REACH SVHC: No SVHC; Width: 0.049inch; Tolerance: 10%
FB2-FB4 = CMP-07252-000001-1: as FB1 on sheet  USB_AB; RoHS: TRUE; Manufacturer Part Number: MH2029-300Y; Temperature Range High: +125°C; Device Class L3: Ferrite Beads and Chips; Core Material: Ferrite; ComponentLink2Description: Datasheet; Category: FBead; Octopart: https://octopart.com/mh2029-300y-bourns-756929; Digikey Description: FERRITE BEAD 30 OHM 0805 1LN; Device Class L2: EMI / RFI Components; Lead Free: Yes; Mouser Description: Ferrite Beads 30 ohms 25% HIGH CURRENT; Automotive: No; Ipc Land Pattern Name: CAPC200120X90; Temperature: -55°C to +125°C; Device Class L1: Passive Components; Height: 1.1mm; ComponentLink2URL: https://www.bourns.com/docs/Product-Datasheets/mh.pdf; Package: MH2029; Temperature Range Low: -55°C

## Sheet  power_supply.SchDoc
size A4
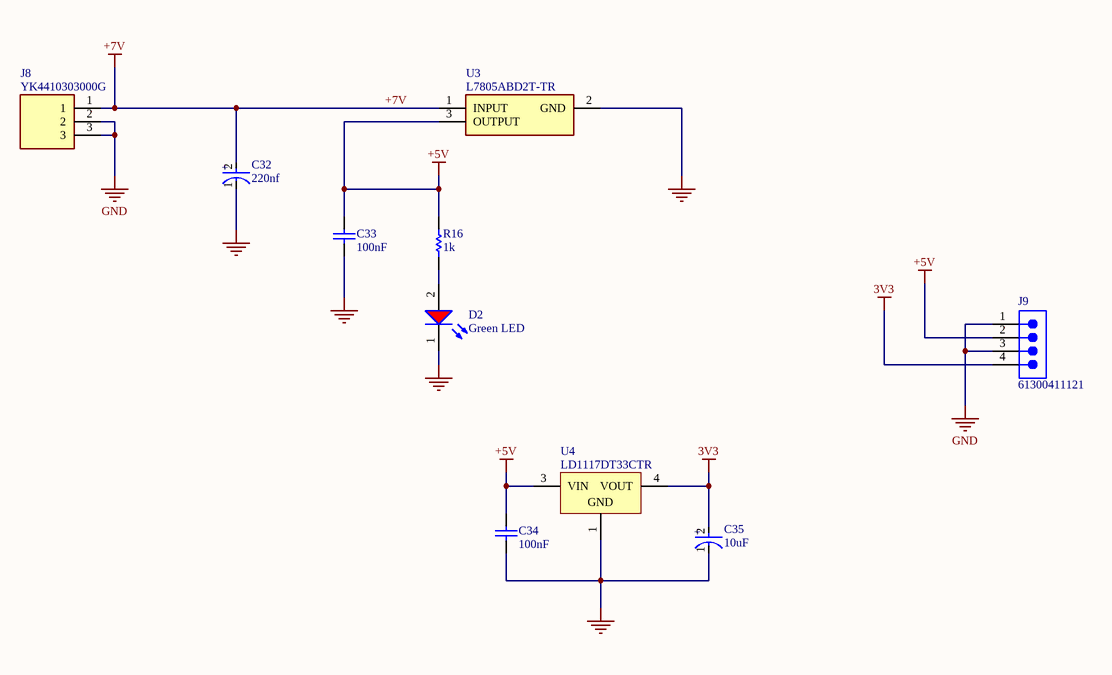
[diagram p4:  power_supply.SchDoc]

### Parts
C32  220nf  [FP-RAD-TH-D_8_0_5-L_15_1-MFG]
C33  100nF  [CAPC2013X140X45NL15T25]
C34  100nF  [CAPC2013X140X45NL15T25]
C35  10uF  [FP-TAJP-MFG]
D2  Green LED  [WL-SMCW_0603_150060xx75000]
J8  YK4410303000G  [YK4410303000G]
J9  61300411121  [61300411121]
R16  1k  [RESC2013X60X35ML10T20]
U3  L7805ABD2T-TR  [L7805ABD2TTR]
U4  LD1117DT33CTR  [TO-252_N]

### Nets
3V3: C35.2(A) J9.4 U4.4(VOUT)
+5V: C33.2 C34.2 J9.2 R16.2 U3.3(OUTPUT) U4.3(VIN)
+7V: C32.2(A) J8.1 U3.1(INPUT)
GND: C32.1(C) C33.1 C34.1 C35.1(C) D2.1(K) J8.2 J8.3 J9.1 J9.3 U3.2(GND) U4.1(GND)
NetD2_2: D2.2(A) R16.1

### Library data of the parts
C32 = CMP-05427-001049-1: Aluminum Electrolytic Capacitors (Radial Lead Type) 120uF ±20% 50V; Lead Diameter: 0.6mm; Impedance: 45mR; Ripple Current: 1.14A; Life (Hours): 3000Hour; Lead Pitch: 5mm; Height: 15mm; Lead Free: Lead Free; Length: 15mm; Termination: Radial; Tolerance: 20%; Radiation Hardening: No; RoHS Compliant: Yes; Voltage Rating: 50V; Diameter: 8mm; Series: FM; Height - Seated (Max): 0.65inch; Packaging: Ammo Pack; Voltage Rating (DC): 50V; Capacitance: 120uF; Case/Package: Radial; ESR (Equivalent Series Resistance): 45mR; Min Operating Temperature: -40°C; Package Quantity: 1000; Max Operating Temperature: 105°C; Mount: Through Hole
C33 C34 = CMP-2007-03352-1: Manufacturer: Murata; Part Number: GCM21BR71H104KA37K
C35 = CMP-2007-04028-2: as C12 on sheet  VDD; Height: 1.5mm; Packaging: Tape and Reel; Max Operating Temperature: 125°C; Lead Free: Lead Free; Length: 2.05mm; RoHS Compliant: Yes; Number of Pins: 2; Case Code (Metric): 2012; Series: TAJ; Height - Seated (Max): 0.059inch; Mount: Surface Mount; REACH SVHC: No SVHC; Depth: 1.35mm; Tolerance: 20%; Case Code (Imperial): 0805; Dielectric Material: Tantalum; Features: General Purpose; Voltage: 10V; Capacitance: 10uF; Package Quantity: 1; Case/Package: 0805; Voltage Rating (DC): 10V; Termination: SMD/SMT; Width: 0.053inch; Min Operating Temperature: -55°C; Voltage Rating: 10V
D2 = CMP-1426-00001-4: LED Low-Power Uni-Color Green 630nm 2V 2-Pin Chip 0603(1608Metric) T/R; Max Junction Temperature (Tj): 95°C; Dominant Wavelength: 625nm; Lens Style: Clear, Rectangular; Viewing Angle: 140°; Forward Current: 100mA; Max Reverse Voltage (DC): 5V; Luminous Intensity: 250mcd; Test Current: 20mA; Power Dissipation: 72mW; Color: Red; Max Operating Temperature: 85°C; Mount: Surface Mount; Height: 700µm; Packaging: Tape and Reel; REACH SVHC: Unknown; Case Code (Metric): 1608; Peak Wavelength: 630nm; Forward Voltage: 2V; Case/Package: 0603; RoHS: Compliant; Width: 800µm; Reverse Voltage: 5V; Min Operating Temperature: -40°C; Wavelength: 625nm; Case Code (Imperial): 0603; Length: 1.6mm
J8 = YK4410303000G: Connector; Manufacturer_Name: Amphenol; Datasheet Link: http://www.anytek.com.tw/UserUpFiles/20170613/GymcEQdigCSS.pdf; Height: 14.5mm; Manufacturer_Part_Number: YK4410303000G; Mouser Part Number: 649-YK44103030J0G; Mouser Price/Stock: https://www.mouser.co.uk/ProductDetail/Amphenol-Anytek/YK4410303000G?qs=Mv7BduZupUjlRBXbQE4gEA%3D%3D
J9 = CMP-1502-01064-3: as P1 on sheet  JTAG; Contact Plating: Gold; Height: 8.89mm; Lead Pitch: 2.54mm; Lead Free: Lead Free; Contact Mating Length: 5.9944mm; Number of Rows: 1; Termination: Solder; Packaging: Bulk; REACH SVHC: Unknown; Min Operating Temperature: -40°C; RoHS: Compliant; Number of Contacts: 4; Voltage Rating: 250V; Color: Black; Max Operating Temperature: 105°C; Contact Material: Copper; Mount: Through Hole; Orientation: Vertical; Number of Pins: 4
R16 = CMP-2100-03671-1: as R7 on sheet  MCU_main-Sheet_1; Number of Pins: 2; Number of Terminations: 2; Datasheet URL: http://www.yageo.com/NewPortal/yageodocoutput?fileName=/pdf/R-Chip/PYu-RC_Group_51_RoHS_L_5.pdf; Length: 0.079inch; Package Description: 2-Pin Surface Mounted Device, Body 2 x 1.25 mm; Depth: 1.25mm; Height: 0.024inch; Military Standard: Not; Case/Package: 0805; Package Reference: 0805; RoHSCompliant: true; Lead Free: LeadFree; Packaging: TapeandReel; Package Quantity: 1; Datasheet Version: Rev. 5, 10/2016; Tolerance: 1%; Min Operating Temperature: -55degC; Voltage Rating: 150V; Composition: ThickFilm; Case Code (Imperial): 0805; Power Rating: 125mW; Width: 0.049inch; Case Code (Metric): 2012; Manufacturer URL: http://www.yageo.com/; Max Operating Temperature: 155degC; REACH SVHC: Unknown; Termination: SMD/SMT
U3 = L7805ABD2T-TR: Integrated Circuit; Manufacturer_Name: STMicroelectronics; Datasheet Link: https://www.st.com/resource/en/datasheet/l78.pdf; Height: 4.83mm; Manufacturer_Part_Number: L7805ABD2T-TR; Mouser Part Number: 511-L7805ABD2T-TR; Mouser Price/Stock: https://www.mouser.co.uk/ProductDetail/STMicroelectronics/L7805ABD2T-TR?qs=LL%252BsqOK9SqOQ%2FfZD5ZsNqA%3D%3D; Arrow Part Number: L7805ABD2T-TR; Arrow Price/Stock: https://www.arrow.com/en/products/l7805abd2t-tr/stmicroelectronics?utm_currency=USD&region=nac
U4 = CMP-0244-00089-1: Fixed Low Drop Positive Voltage Regulator, 3.3V, 3-Pin DPAK, Tape and Reel; PackageVersion: 2011; ComponentLink1URL: http://www.st.com; DatasheetVersion: 1/11/2011; PackageReference: TO-252; ComponentLink1Description: Manufacturer URL; ComponentLink2URL: http://www.st.com/internet/com/TECHNICAL_RESOURCES/TECHNICAL_LITERATURE/DATASHEET/CD00000544.pdf; ComponentLink2Description: Datasheet; PackageDescription: 3-Pin Transistor Outline Package 2.28 mm Pitch, 9.7 mm Lead Span (DPAK)

## Sheet  Communication.SchDoc
size A4
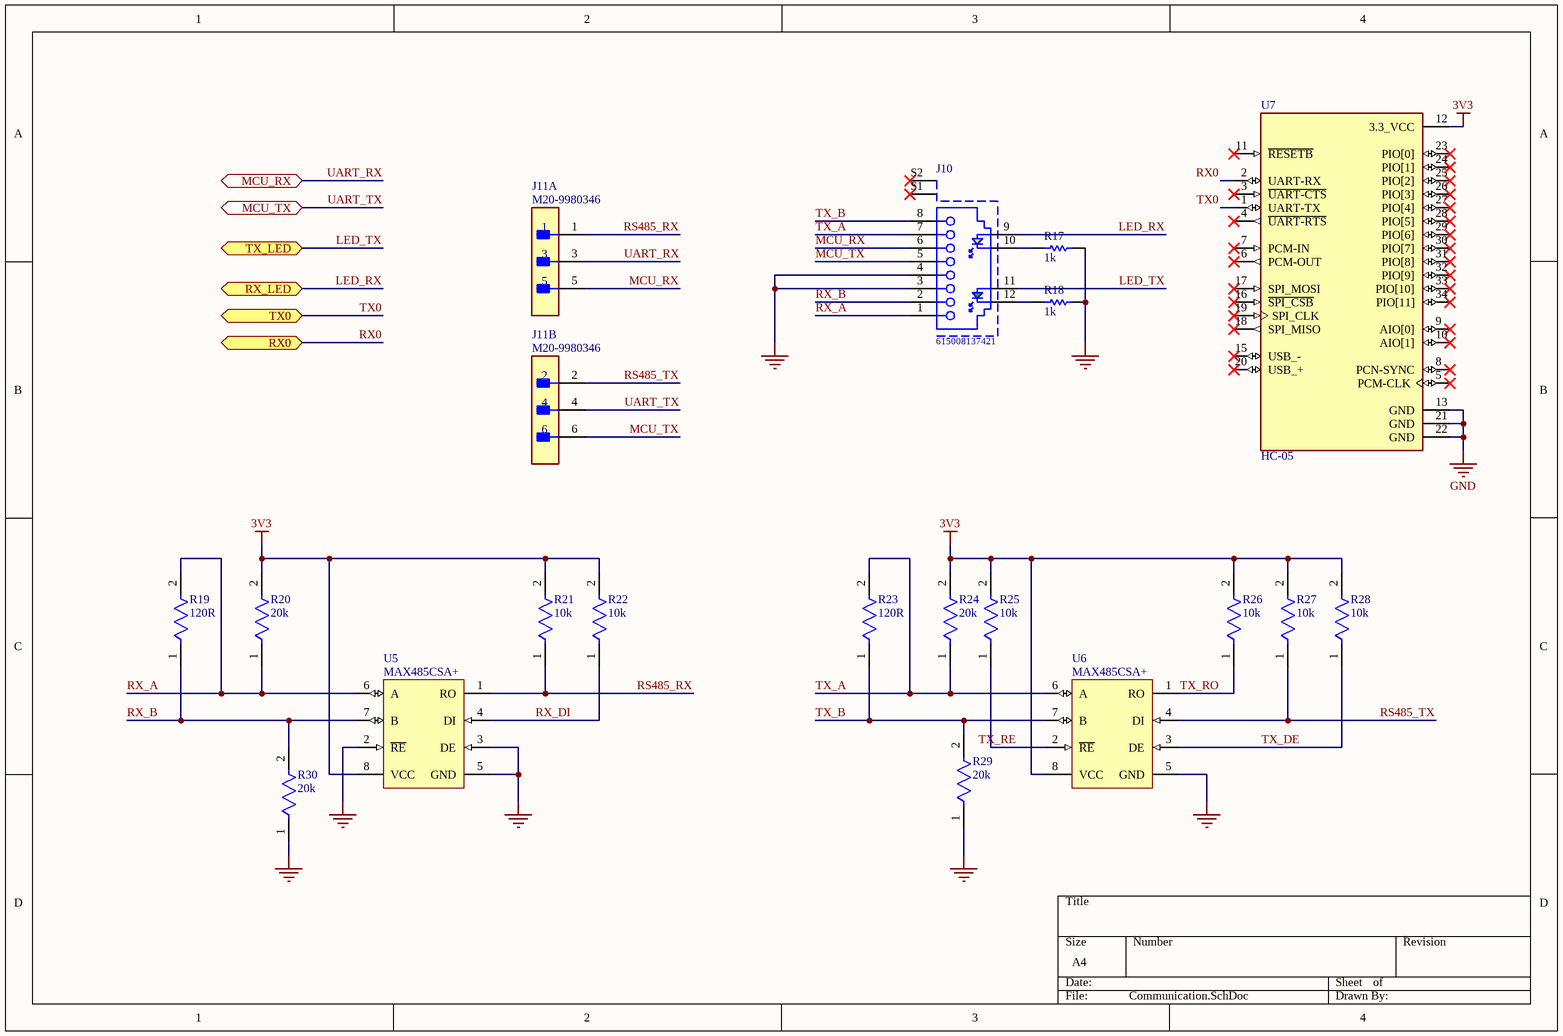
[diagram p5:  Communication.SchDoc]

### Parts
J10  615008137421  [615008137421]
J11  M20-9980346  [FP-M20-9980346-MFG]  (parts A,B of 2)
R17  1k  [RESC2013X60X35ML10T20]
R18  1k  [RESC2013X60X35ML10T20]
R19  120R  [FP-CRCW0805-e3-IPC_A]
R20  20k  [FP-CRCW0805-e3-IPC_A]
R21  10k  [FP-CRCW0805-e3-IPC_A]
R22  10k  [FP-CRCW0805-e3-IPC_A]
R23  120R  [FP-CRCW0805-e3-IPC_A]
R24  20k  [FP-CRCW0805-e3-IPC_A]
R25  10k  [FP-CRCW0805-e3-IPC_A]
R26  10k  [FP-CRCW0805-e3-IPC_A]
R27  10k  [FP-CRCW0805-e3-IPC_A]
R28  10k  [FP-CRCW0805-e3-IPC_A]
R29  20k  [FP-CRCW0805-e3-IPC_A]
R30  20k  [FP-CRCW0805-e3-IPC_A]
U5  MAX485CSA+  [MAXM-MAX485CSA+-8_M]
U6  MAX485CSA+  [MAXM-MAX485CSA+-8_M]
U7  HC-05  [XCVR_HC-05]

### Ports
MCU_RX (bidir), MCU_TX (bidir), RX0 (bidir), RX_LED (bidir), TX0 (bidir), TX_LED (bidir)

### Nets
3V3: R20.2 R21.2 R22.2 R24.2 R25.2 R26.2 R27.2 R28.2 U5.8(VCC) U6.8(VCC) U7.12(3.3_VCC)
GND: J10.3 J10.4 R17.2 R18.2 R29.1 R30.1 U5.2(~{RE}) U5.3(DE) U5.5(GND) U6.5(GND) U7.13(GND) U7.21(GND) U7.22(GND)
LED_RX: J10.9 ; port RX_LED
LED_TX: J10.11 ; port TX_LED
MCU_RX: J10.6 J11.5
MCU_TX: J10.5 J11.6
RS485_RX: J11.1 R21.1 U5.1(RO)
RS485_TX: J11.2 R27.1 U6.4(DI)
RX0: U7.2(UART-RX) ; port RX0
RX_A: J10.1 R19.2 R20.1 U5.6(A)
RX_B: J10.2 R19.1 R30.2 U5.7(B)
RX_DI: R22.1 U5.4(DI)
TX0: U7.1(UART-TX) ; port TX0
TX_A: J10.7 R23.2 R24.1 U6.6(A)
TX_B: J10.8 R23.1 R29.2 U6.7(B)
TX_DE: R28.1 U6.3(DE)
TX_RE: R25.1 U6.2(~{RE})
TX_RO: R26.1 U6.1(RO)
UART_RX: J11.3 ; port MCU_RX
UART_TX: J11.4 ; port MCU_TX
NetJ10_10: J10.10 R17.1
NetJ10_12: J10.12 R18.1

Not connected (* = marked no-connect by the designer): J10 S1* S2*; U7 3(~{UART-CTS})* 4(~{UART-RTS})* 5(PCM-CLK)* 6(PCM-OUT)* 7(PCM-IN)* 8(PCN-SYNC)* 9(AIO[0])* 10(AIO[1])* 11(~{RESETB})* 15(USB_-)* 16(~{SPI_CSB})* 17(SPI_MOSI)* 18(SPI_MISO)* 19(SPI_CLK)* 20(USB_+)* 23(PIO[0])* 24(PIO[1])* 25(PIO[2])* 26(PIO[3])* 27(PIO[4])* 28(PIO[5])* 29(PIO[6])* 30(PIO[7])* 31(PIO[8])* 32(PIO[9])* 33(PIO[10])* 34(PIO[11])*

### Library data of the parts
J10 = CMP-1502-01697-1: Modular Jack WR-MJ, Tab Up, Shielded, with LED and EMI Panel Finger, Horizontal Entry, THT, 8P8C; Manufacturer: Wurth Elektronik; Compliance: Leadfree/RoHS; Withstanding Voltage: 1000VAC; Port: 1x1; Contact Resistance: 20mOhm; Rated Current: 1.5A; Working Voltage: 120VAC; Manufacturer URL: http://www.we-online.de; Mounting Technology: THT; Entrance: Horizontal; Datasheet URL: https://katalog.we-online.de/em/datasheet/615008137421.pdf; Packaging: Tray; Package Reference: 615008137421; Publisher: WurthElektronik; Operating Temperature: -40to85degC; Part Number: 615008137421; Pin Number: 8P8C
J11 = CMP-2000-06636-2: as J6 on sheet  JTAG; Device Class L1: Connectors; ComponentLink2Description: Datasheet; Height: 8.99mm; Temperature Range High: +105°C; Contact Material: Tin,Nickel; RoHS: TRUE; Temperature Range Low: -40°C; ComponentLink2URL: https://cdn.harwin.com/pdfs/M20-998.pdf; Digikey Description: CONN HEADER VERT 6POS 2.54MM; Pitch: 2.54mm; Package: M20-9980346; Device Class L2: Headers and Wire Housings; Manufacturer Part Number: M20-9980346; Number Of Rows: 2; Category: Conn; Lead Free: Yes; Mouser Description: 2.54mm (0.1") Pitch DIL Vertical PC Tail Pin Header, 6.1mm mating pin height, tin, 3+3 contacts; Temperature: -40°C to +105°C; Device Class L3: unset; Octopart: https://octopart.com/m20-9980346-harwin-5436545; Automotive: No
R17 R18 = CMP-2100-03671-1: as R7 on sheet  MCU_main-Sheet_1; Number of Pins: 2; Number of Terminations: 2; Datasheet URL: http://www.yageo.com/NewPortal/yageodocoutput?fileName=/pdf/R-Chip/PYu-RC_Group_51_RoHS_L_5.pdf; Length: 0.079inch; Package Description: 2-Pin Surface Mounted Device, Body 2 x 1.25 mm; Depth: 1.25mm; Height: 0.024inch; Military Standard: Not; Case/Package: 0805; Package Reference: 0805; RoHSCompliant: true; Lead Free: LeadFree; Packaging: TapeandReel; Package Quantity: 1; Datasheet Version: Rev. 5, 10/2016; Tolerance: 1%; Min Operating Temperature: -55degC; Voltage Rating: 150V; Composition: ThickFilm; Case Code (Imperial): 0805; Power Rating: 125mW; Width: 0.049inch; Case Code (Metric): 2012; Manufacturer URL: http://www.yageo.com/; Max Operating Temperature: 155degC; REACH SVHC: Unknown; Termination: SMD/SMT
R19 R21-R23 R25-R28 = CMP-2001-04908-2: as R11 on sheet  USB_AB; Weight: 0.000194oz; Package Quantity: 5000; Military Standard: Not; Max Operating Temperature: 155°C; Temperature Coefficient: 100ppm/°C; Contact Plating: Tin; Width: 1.25mm; Height: 0.45mm; Radiation Hardening: No; Tolerance: 1%; Min Operating Temperature: -55°C; Voltage Rating: 150V; Length: 2mm; Depth: 1.25mm; Termination: SMD/SMT; Packaging: Tape and Reel; Case/Package: 0805; Case Code (Metric): 2012; Lead Free: Lead Free; Case Code (Imperial): 0805; Composition: Thick Film
R20 R24 R29 R30 = CMP-2001-04908-2: RES Thick Film, 20kΩ, 1%, 0.125W, 100ppm/°C, 0805; Resistance: 10kR; Voltage Rating (DC): 150V; Power Rating: 125mW; Weight: 0.000194oz; Package Quantity: 5000; Military Standard: Not; Max Operating Temperature: 155°C; Temperature Coefficient: 100ppm/°C; Contact Plating: Tin; Width: 1.25mm; Height: 0.45mm; Radiation Hardening: No; Tolerance: 1%; Min Operating Temperature: -55°C; Voltage Rating: 150V; Length: 2mm; Depth: 1.25mm; Termination: SMD/SMT; Packaging: Tape and Reel; Case/Package: 0805; Case Code (Metric): 2012; Lead Free: Lead Free; Case Code (Imperial): 0805; Composition: Thick Film
U5 U6 = CMP-2000-05211-1: Low-Power, Slew-Rate-Limited RS-485/RS-422 Transceiver, 4.75 to 5.25 V, 0 to 70 degC, 8-Pin SOIC, RoHS, Tape and Reel; Manufacturer: Maxim; No. of Receivers: 1; Transceiver Type: Differential; Supply Voltage Min: 4.75V; IC Generic Number: 485; IC Temperature Range: Commercial; No. of Pins: 8; Supply Voltage Range: 4.75Vto5.25V; Interface: RS-422/RS-485; Supply Voltage Max: 5.25V; Data Rate: 2.5Mbps; Line / Bus Driver / Receiver / Transceiver Type: CMOSDifferential; Supply Current: 500µA; Interface Type: RS422,RS485; Device Type: Transceiver; Manufacturer URL: http://www.maximintegrated.com/; Operating Temperature Range: 0degCto+70degC; Package / Case: SOIC; Digital IC Case Style: SOIC; Operating Temperature Max: 70degC; Device Marking: MAX485CSA+; Driver Case Style: SOIC; Datasheet Version: Rev. 8, 10/2003; Operating Temperature Min: 0degC; Datasheet URL: https://datasheet.ciiva.com/29306/170071-da-01-en-ic-max485csa-so8-29306144.pdf; Base Number: 485; No. of Drivers: 1; Logic Function Number: 485
U7 = HC-05: Bluetooth to Serial Port Module; MF: ITead Studio; SnapEDA_Link: https://www.snapeda.com/parts/HC-05/ITEAD/view-part/?ref=snap; Package: Module ITead Studio; Value: *; MP: HC-05; Check_prices: https://www.snapeda.com/parts/HC-05/ITEAD/view-part/?ref=eda

## Nets that join several sheets
3V3:  MCU_main-Sheet_1 (13 pins),  USB_AB (R9.2 R10.2),  JTAG (5 pins),  VDD (9 pins),  power_supply (C35.2 J9.4 U4.4),  Communication (11 pins)
+5V:  MCU_main-Sheet_1 (U2.1),  USB_AB (C10.1 C11.1 F1.2 R11.2),  JTAG (J6.1),  power_supply (6 pins)
GND:  MCU_main-Sheet_1 (26 pins),  USB_AB (16 pins),  JTAG (5 pins),  VDD (20 pins),  power_supply (11 pins),  Communication (13 pins)